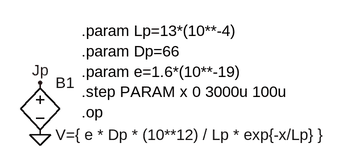
[diagram p0: schematic 3-4-b-1.asc]
3-4-b-1.asc, the LTspice schematic file:
Version 4
SHEET 1 880 680
FLAG -368 320 0
FLAG -368 240 Jp
SYMBOL bv -368 224 R0
SYMATTR InstName B1
SYMATTR Value V={ e * Dp * (10**12) / Lp * exp{-x/Lp} }
TEXT -304 160 Left 2 !.param Lp=13*(10**-4)\n.param Dp=66\n.param e=1.6*(10**-19)\n.step PARAM x 0 3000u 100u\n.op

The netlist it stands for:
* 3-4-b-1.asc
B1 Jp 0 V={ e * Dp * (10**12) / Lp * exp{-x/Lp} }
.param Lp=13*(10**-4)
.param Dp=66
.param e=1.6*(10**-19)
.step PARAM x 0 3000u 100u
.op
.backanno
.end